# Altium schematic sheet EE3102_PCB_Proj.SchDoc
size B
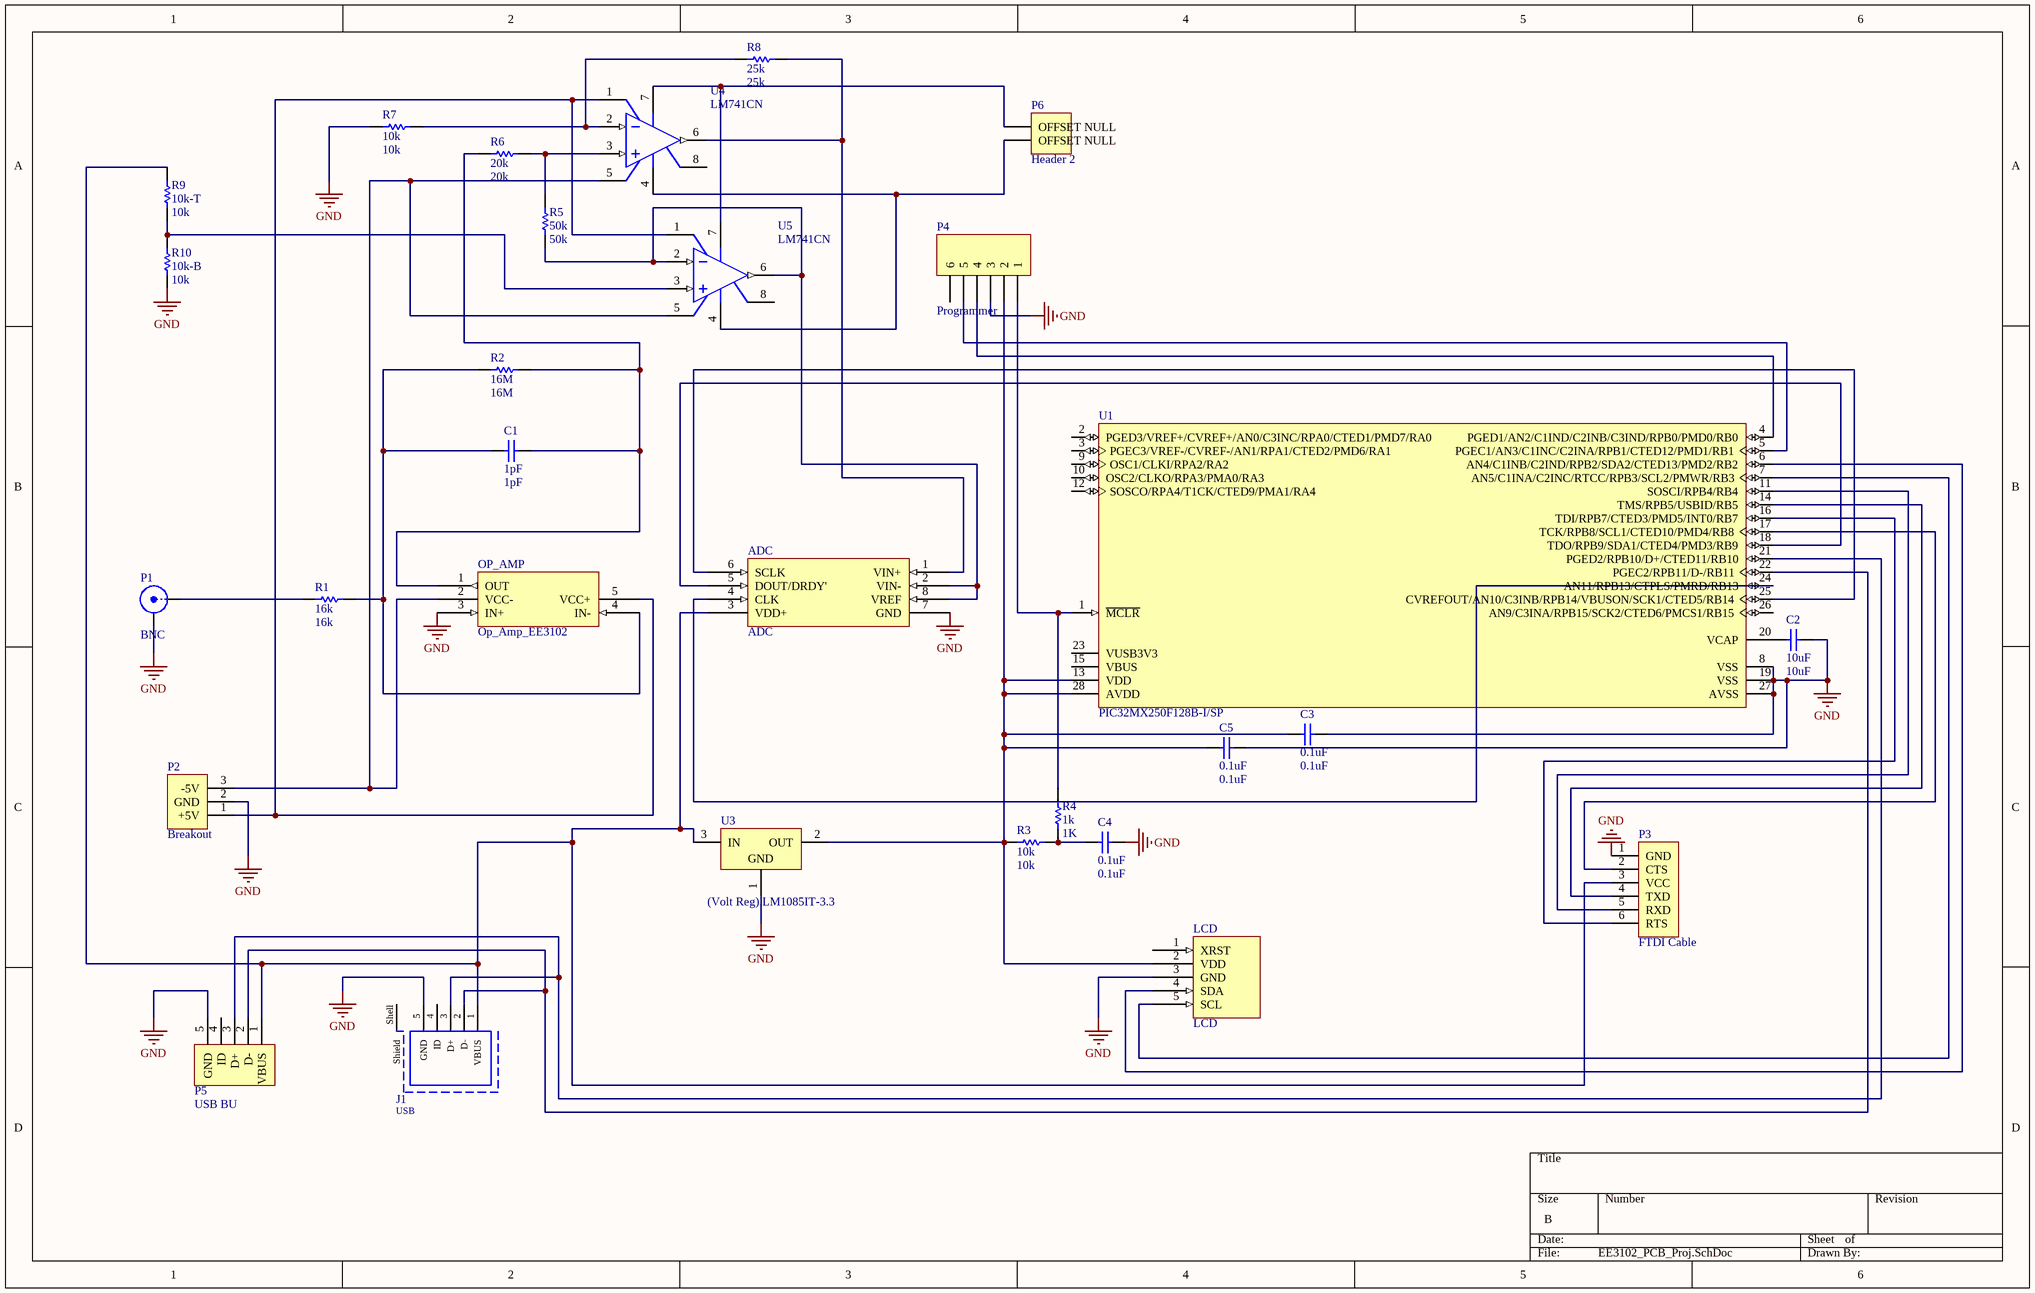
[diagram p0: EE3102_PCB_Proj.SchDoc]

## Parts
ADC  ADC  [ADC]
C1  1pF  [RAD-0.3]
C2  10uF  [RAD-0.3]
C3  0.1uF  [RAD-0.3]
C4  0.1uF  [RAD-0.3]
C5  0.1uF  [RAD-0.3]
J1  USB  [629105150921]
LCD  LCD  [LCD]
OP_AMP  Op_Amp_EE3102  [Op_Amp]
P1  BNC  [BNC_RA CON]
P2  Breakout  [HDR1X3]
P3  FTDI Cable  [HDR1X6]
P4  Programmer  [HDR1X6]
P5  USB BU  [HDR1X5]
P6  Header 2  [HDR1X2]
R1  16k  [AXIAL-0.3]
R2  16M  [AXIAL-0.3]
R3  10k  [AXIAL-0.3]
R4  1k  [AXIAL-0.3]
R5  50k  [AXIAL-0.3]
R6  20k  [AXIAL-0.3]
R7  10k  [AXIAL-0.3]
R8  25k  [AXIAL-0.3]
R9  10k-T  value 10k  [AXIAL-0.3]
R10  10k-B  value 10k  [AXIAL-0.3]
U1  PIC32MX250F128B-I/SP  [MCHP-SPDIP-SP28]
U3  (Volt Reg) LM1085IT-3.3  [T03B]
U4  LM741CN  [N08E]
U5  LM741CN  [N08E]

## Nets
GND: ADC.7(GND) C2.2 C3.2 C4.2 C5.2 J1.5(GND) LCD.3(GND) OP_AMP.3(IN+) P1.2(Y) P2.2(GND) P3.1(GND) P4.3 P5.5(GND) R7.1 R10.1 U1.8(VSS) U1.19(VSS) U1.27(AVSS) U3.1(GND)
NetADC_1: ADC.1(VIN+) R8.2 U4.6(OUT)
NetADC_2: ADC.2(VIN-) ADC.8(VREF) R5.2 U5.2(IN-) U5.6(OUT)
NetADC_3: ADC.3(VDD+) J1.1(VBUS) P3.3(VCC) P5.1(VBUS) R9.2 U3.3(IN)
NetADC_4: ADC.4(CLK) U1.24(AN11/RPB13/CTPLS/PMRD/RB13)
NetADC_5: ADC.5(DOUT/DRDY') U1.18(TDO/RPB9/SDA1/CTED4/PMD3/RB9)
NetADC_6: ADC.6(SCLK) U1.25(CVREFOUT/AN10/C3INB/RPB14/VBUSON/SCK1/CTED5/RB14)
NetC1_1: C1.1 OP_AMP.4(IN-) R1.2 R2.1
NetC1_2: C1.2 OP_AMP.1(OUT) R2.2 R6.1
NetC2_1: C2.1 U1.20(VCAP)
NetC3_1: C3.1 C5.1 LCD.2(VDD) P4.2 R3.2 U1.13(VDD) U1.28(AVDD) U3.2(OUT)
NetC4_1: C4.1 R3.1 R4.1
NetJ1_2: J1.2(D-) P5.2(D-) U1.22(PGEC2/RPB11/D-/RB11)
NetJ1_3: J1.3(D+) P5.3(D+) U1.21(PGED2/RPB10/D+/CTED11/RB10)
NetLCD_4: LCD.4(SDA) U1.6(AN4/C1INB/C2IND/RPB2/SDA2/CTED13/PMD2/RB2)
NetLCD_5: LCD.5(SCL) U1.7(AN5/C1INA/C2INC/RTCC/RPB3/SCL2/PMWR/RB3)
NetOP_AMP_2: OP_AMP.2(VCC-) P2.3(-5V) U4.5(OFS_NULL) U5.5(OFS_NULL)
NetOP_AMP_5: OP_AMP.5(VCC+) P2.1(+5V) U4.1(OFS_NULL) U5.1(OFS_NULL)
NetP1_1: P1.1(X) R1.1
NetP3_2: P3.2(CTS) U1.17(TCK/RPB8/SCL1/CTED10/PMD4/RB8)
NetP3_4: P3.4(TXD) U1.14(TMS/RPB5/USBID/RB5)
NetP3_5: P3.5(RXD) U1.11(SOSCI/RPB4/RB4)
NetP3_6: P3.6(RTS) U1.16(TDI/RPB7/CTED3/PMD5/INT0/RB7)
NetP4_1: P4.1 R4.2 U1.1(~{MCLR})
NetP4_4: P4.4 U1.4(PGED1/AN2/C1IND/C2INB/C3IND/RPB0/PMD0/RB0)
NetP4_5: P4.5 U1.5(PGEC1/AN3/C1INC/C2INA/RPB1/CTED12/PMD1/RB1)
NetP6_1: P6.1(OFFSET_NULL) U4.7(V+) U5.7(V+)
NetP6_2: P6.2(OFFSET_NULL) U4.4(V-) U5.4(V-)
NetR5_1: R5.1 R6.2 U4.3(IN+)
NetR7_2: R7.2 R8.1 U4.2(IN-)
NetR9_1: R9.1 R10.2 U5.3(IN+)

Not connected (* = marked no-connect by the designer): J1 4(ID) Shell(Shield); LCD 1(XRST); P4 6; P5 4(ID); U1 2(PGED3/VREF+/CVREF+/AN0/C3INC/RPA0/CTED1/PMD7/RA0) 3(PGEC3/VREF-/CVREF-/AN1/RPA1/CTED2/PMD6/RA1) 9(OSC1/CLKI/RPA2/RA2) 10(OSC2/CLKO/RPA3/PMA0/RA3) 12(SOSCO/RPA4/T1CK/CTED9/PMA1/RA4) 15(VBUS) 23(VUSB3V3) 26(AN9/C3INA/RPB15/SCK2/CTED6/PMCS1/RB15); U4 8(NC); U5 8(NC)

## Library data of the parts
C1-C5 = Cap: Capacitor; Published: 8-Jun-2000; LatestRevisionDate: 17-Jul-2002; LatestRevisionNote: Re-released for DXP Platform.; PackageReference: RAD-0.3; Publisher: Altium Limited; PackageDescription: Radial Cap, Thru-Hole; 2 Leads; 0.3 in Pin Spacing
  C1: Value: 1pF
  C2: Value: 10uF
  C3-C5: Value: 0.1uF
J1 = 629105150921: Micro USB 2.0 Type AB Receptacle WR-COM, Horizontal, SMT; Rated Current: 1.8 A; Contact Resistance: 30 mOhm; Working Voltage: 30 VAC; ComponentLink1Description: Manufacturer; ComponentLink1URL: http://www.we-online.de; ComponentLink2Description: Datasheet; ComponentLink2URL: https://katalog.we-online.de/em/datasheet/629105150921.pdf; Part Number: 629105150921; Published Date: September 2018; Publisher: Wurth Elektronik; Orientation: Horizontal; Connector Type: Micro USB 2.0 Type AB; Operating Temperature: -40 to 85 degC; Mounting Technology: SMT; Gender: Receptacle; Packaging: Tape and Reel
OP_AMP = Op_Amp
P1 = BNC: BNC Elbow Connector; LatestRevisionDate: 17-Jul-2002; LatestRevisionNote: Re-released for DXP Platform.; Publisher: Altium Limited
P2 = Header 3: Header, 3-Pin; LatestRevisionDate: 17-Jul-2002; LatestRevisionNote: Re-released for DXP Platform.; Publisher: Altium Limited
P3 P4 = Header 6: Header, 6-Pin; LatestRevisionDate: 17-Jul-2002; LatestRevisionNote: Re-released for DXP Platform.; Publisher: Altium Limited
P5 = Header 5: Header, 5-Pin; LatestRevisionDate: 17-Jul-2002; LatestRevisionNote: Re-released for DXP Platform.; Publisher: Altium Limited
P6 = Header 2: Header, 2-Pin; LatestRevisionDate: 17-Jul-2002; LatestRevisionNote: Re-released for DXP Platform.; Publisher: Altium Limited
R1-R10 = Res1: Resistor; Published: 8-Jun-2000; LatestRevisionDate: 17-Jul-2002; LatestRevisionNote: Re-released for DXP Platform.; PackageReference: AXIAL-0.3; Publisher: Altium Limited; PackageDescription: Axial Device, Thru-Hole; 2 Leads; 0.3 in Pin Spacing
  R1: Value: 16k
  R2: Value: 16M
  R3 R7: Value: 10k
  R4: Value: 1K
  R5: Value: 50k
  R6: Value: 20k
  R8: Value: 25k
U1 = PIC32MX250F128B-I/SP: 32-bit Microcontroller with Audio and Graphics Interface, USB and Advanced Analog, 50 MHz, 19 I/O, PMP, -40 to 85 degC, 28-pin SPDIP (SP28), Tube; Manufacturer: Microchip; DatasheetVersion: Rev. E; PackageVersion: C04-070B; PackageReference: SPDIP-SP28; PackageDescription: 28-Lead Plastic Dual In-Line, 34.86 x 6.79 mm Body, 2.54 mm Pitch; Supplier 1: Digi-Key; Supplier Part Number 1: PIC32MX250F128B-I/SP-ND; Supplier 2: Farnell; Supplier Part Number 2: 2097773; Supplier 3: Newark; Supplier Part Number 3: 73T1453; Supplier 4: Mouser; Supplier Part Number 4: 579-32MX250F128BISP; Mounting Technology: Through Hole; PartNumber: PIC32MX250F128B-I/SP; ComponentLink1Description: Manufacturer URL; ComponentLink1URL: http://www.microchip.com; ComponentLink2Description: Datasheet; ComponentLink2URL: http://ww1.microchip.com/downloads/en/DeviceDoc/61168E.pdf; ComponentLink3Description: Package Specification; ComponentLink3URL: http://www.microchip.com/stellent/groups/techpub_sg/documents/packagingspec/en012702.pdf; ComponentLink4Description: Product URL; ComponentLink4URL: http://www.microchip.com/PIC32MX250F128B
U3 = LM1085IT-3.3: 3A Low Dropout Positive Regulators, 3-pin TO-220; Manufacturer: National Semiconductor; PackageTopMarking: NSUZXYTTE#*LM1085*IT-3.3; PowerWise: N; CompType: LDO IC; High-Reliability: Y; DatasheetVersion: Jun-2005; PackageVersion: revL, Jan-1992; PackageReference: T03B; PackageDescription: TO-220, Molded, 3 Lead, Straight; PartNumber: LM1085IT-3.3; RoHS: N; PinCount: 3; ComponentLink1Description: Manufacturer URL; ComponentLink1URL: http://www.national.com/; ComponentLink2Description: LM1085 Datasheet; ComponentLink2URL: http://www.national.com/ds/LM/LM1085.pdf; ComponentLink3Description: LM1085 Web Page; ComponentLink3URL: http://www.national.com/pf/LM/LM1085.html; ComponentLink4Description: T03B Package Page; ComponentLink4URL: http://www.national.com/packaging/folders/t03b.html
U4 U5 = LM741CN: Operational Amplifier, 8-pin MDIP; Manufacturer: National Semiconductor; PackageTopMarking: NSUZXYTTE#*LM*741CN; PowerWise: N; CompType: Amplifiers; High-Reliability: Y; DatasheetVersion: Aug-2000; PackageVersion: revG, May-2006; PackageReference: N08E; PackageDescription: MDIP, .365 x .250 x .130in, 8 Lead, .100in Pitch; PartNumber: LM741CN; RoHS: N; PinCount: 8; Code_JEDEC: MS-001-BA; ComponentLink1Description: Manufacturer URL; ComponentLink1URL: http://www.national.com/; ComponentLink2Description: LM741 Datasheet; ComponentLink2URL: http://www.national.com/ds/LM/LM741.pdf; ComponentLink3Description: LM741 Web Page; ComponentLink3URL: http://www.national.com/pf/LM/LM741.html; ComponentLink4Description: N08E Package Page; ComponentLink4URL: http://www.national.com/packaging/folders/n08e.html